# Altium schematic sheet Top_Level.SchDoc
size 431 x 279 mm; SheetNumber: 1; SheetTotal: 5
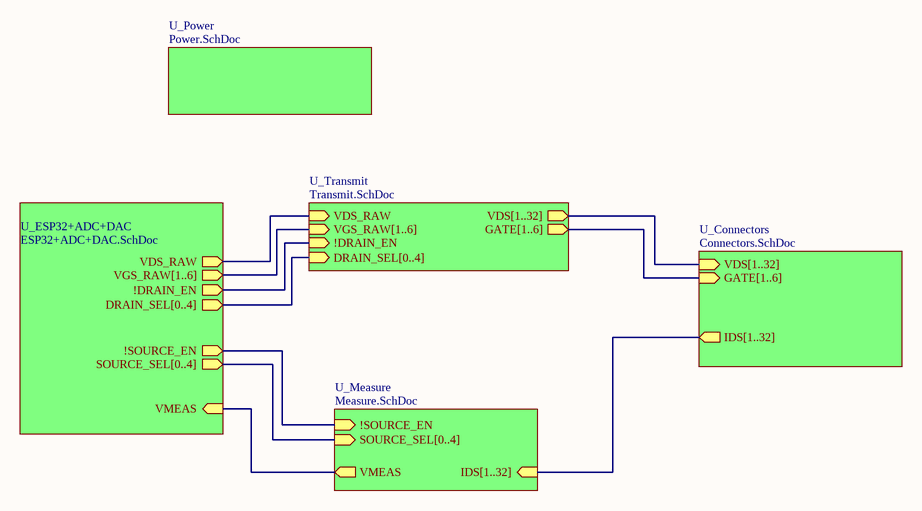
[diagram p0: Top_Level.SchDoc]

## Sub-sheets
U_Connectors = Connectors.SchDoc: GATE[1..6] (in), VDS[1..32] (in), IDS[1..32] (out)
U_ESP32+ADC+DAC = ESP32+ADC+DAC.SchDoc: VDS_RAW (out), VGS_RAW[1..6] (out), !SOURCE_EN (out), !DRAIN_EN (out), DRAIN_SEL[0..4] (out), SOURCE_SEL[0..4] (out), VMEAS (in)
U_Measure = Measure.SchDoc: IDS[1..32] (in), !SOURCE_EN (in), SOURCE_SEL[0..4] (in), VMEAS (out)
U_Power = Power.SchDoc: no entries
U_Transmit = Transmit.SchDoc: VDS_RAW (in), !DRAIN_EN (in), DRAIN_SEL[0..4] (in), VDS[1..32] (out), GATE[1..6] (out), VGS_RAW[1..6] (in)

## Nets
(unnamed): sheet U_Measure/!SOURCE_EN, sheet U_ESP32+ADC+DAC/!SOURCE_EN
(unnamed): sheet U_Measure/VMEAS, sheet U_ESP32+ADC+DAC/VMEAS
(unnamed): sheet U_ESP32+ADC+DAC/VDS_RAW, sheet U_Transmit/VDS_RAW
(unnamed): sheet U_ESP32+ADC+DAC/!DRAIN_EN, sheet U_Transmit/!DRAIN_EN

## Buses and harness runs
bus sheet U_Connectors/GATE[1..6] = sheet U_Transmit/GATE[1..6]
bus sheet U_Connectors/IDS[1..32] = sheet U_Measure/IDS[1..32]
bus sheet U_Connectors/VDS[1..32] = sheet U_Transmit/VDS[1..32]
bus sheet U_ESP32+ADC+DAC/DRAIN_SEL[0..4] = sheet U_Transmit/DRAIN_SEL[0..4]
bus sheet U_ESP32+ADC+DAC/SOURCE_SEL[0..4] = sheet U_Measure/SOURCE_SEL[0..4]
bus sheet U_ESP32+ADC+DAC/VGS_RAW[1..6] = sheet U_Transmit/VGS_RAW[1..6]

## Notes on the sheet
- DWG. NO.
- REV.
- SHT.
- THIS DOCUMENT AND THE DATA DISCLOSED HEREIN OR HEREWITH IS THE PROPERTY OF ALTIUM LIMITED AND MAY BE FREELY DISTRIBUTED IN WHOLE. NO RIGHTS ARE RESERVED OR EXPRESS OR IMPLIED WARANTEE GIVEN.
- REVISION
- DESCRIPTION
- DATE
- APPROVED
- ENG:
- APPROVALS
- PROJECT
- DSN:
- CHK:
- REFERENCE DOCUMENTS
- PROJECT REVISION:
- TITLE
- DOCUMENT REVISION:
- DESIGN ITEM:
- BOM:
- FAB DWG:
- PCB DWG:
- ASSY DWG:
- SCALE:
- SIZE
- B
- CAGE CODE
- FILE NAME
- DWG NO.
- SHEET
- OF
- REV